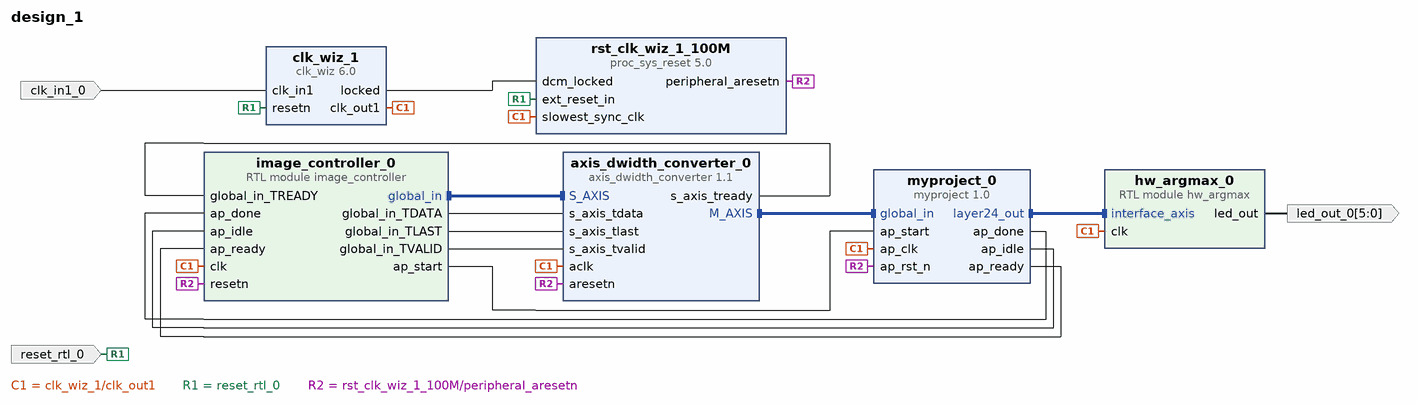
[diagram p0: block diagram of the top level]
# Vivado block design design_1, xc7a35tftg256-1, Vivado 2026.1
create_bd_design design_1

create_bd_port -dir I -type rst reset_rtl_0
set_property -dict {CONFIG.POLARITY ACTIVE_LOW} [get_bd_ports reset_rtl_0]
create_bd_port -dir I -type clk clk_in1_0
set_property -dict {CONFIG.FREQ_HZ 50000000} [get_bd_ports clk_in1_0]
create_bd_port -dir O -from 5 -to 0 led_out_0

create_bd_cell -type ip -vlnv xilinx.com:ip:clk_wiz:6.0 clk_wiz_1
set_property -dict [list \
  CONFIG.CLKIN1_JITTER_PS 200.0 \
  CONFIG.CLKOUT1_JITTER 943.481 \
  CONFIG.CLKOUT1_PHASE_ERROR 919.522 \
  CONFIG.CLKOUT1_REQUESTED_OUT_FREQ 5.000 \
  CONFIG.MMCM_CLKFBOUT_MULT_F 64.000 \
  CONFIG.MMCM_CLKIN1_PERIOD 20.000 \
  CONFIG.MMCM_CLKIN2_PERIOD 10.0 \
  CONFIG.MMCM_CLKOUT0_DIVIDE_F 128.000 \
  CONFIG.MMCM_DIVCLK_DIVIDE 5 \
  CONFIG.PRIM_IN_FREQ 50.000 \
  CONFIG.PRIM_SOURCE Single_ended_clock_capable_pin \
  CONFIG.RESET_PORT resetn \
  CONFIG.RESET_TYPE ACTIVE_LOW \
] [get_bd_cells clk_wiz_1]
create_bd_cell -type ip -vlnv xilinx.com:ip:proc_sys_reset:5.0 rst_clk_wiz_1_100M
create_bd_cell -type module -reference image_controller image_controller_0
create_bd_cell -type module -reference hw_argmax hw_argmax_0
create_bd_cell -type ip -vlnv xilinx.com:ip:axis_dwidth_converter:1.1 axis_dwidth_converter_0
set_property -dict [list \
  CONFIG.HAS_TLAST 1 \
  CONFIG.M_TDATA_NUM_BYTES 56 \
  CONFIG.S_TDATA_NUM_BYTES 2 \
] [get_bd_cells axis_dwidth_converter_0]
create_bd_cell -type ip -vlnv xilinx.com:hls:myproject:1.0 myproject_0

# ---- connections ----

connect_bd_intf_net [get_bd_intf_pins myproject_0/global_in] [get_bd_intf_pins axis_dwidth_converter_0/M_AXIS]
connect_bd_intf_net [get_bd_intf_pins image_controller_0/global_in] [get_bd_intf_pins axis_dwidth_converter_0/S_AXIS]
connect_bd_intf_net [get_bd_intf_pins myproject_0/layer24_out] [get_bd_intf_pins hw_argmax_0/interface_axis]
connect_bd_net [get_bd_pins axis_dwidth_converter_0/s_axis_tready] [get_bd_pins image_controller_0/global_in_TREADY]
connect_bd_net -net clk_in1_0_1 [get_bd_ports clk_in1_0] [get_bd_pins clk_wiz_1/clk_in1]
connect_bd_net [get_bd_pins clk_wiz_1/locked] [get_bd_pins rst_clk_wiz_1_100M/dcm_locked]
connect_bd_net [get_bd_pins hw_argmax_0/led_out] [get_bd_ports led_out_0]
connect_bd_net [get_bd_pins image_controller_0/ap_start] [get_bd_pins myproject_0/ap_start]
connect_bd_net [get_bd_pins image_controller_0/global_in_TDATA] [get_bd_pins axis_dwidth_converter_0/s_axis_tdata]
connect_bd_net [get_bd_pins image_controller_0/global_in_TLAST] [get_bd_pins axis_dwidth_converter_0/s_axis_tlast]
connect_bd_net [get_bd_pins image_controller_0/global_in_TVALID] [get_bd_pins axis_dwidth_converter_0/s_axis_tvalid]
connect_bd_net -net microblaze_0_Clk [get_bd_pins clk_wiz_1/clk_out1] \
  [get_bd_pins rst_clk_wiz_1_100M/slowest_sync_clk] [get_bd_pins hw_argmax_0/clk] [get_bd_pins axis_dwidth_converter_0/aclk] \
  [get_bd_pins image_controller_0/clk] [get_bd_pins myproject_0/ap_clk]
connect_bd_net [get_bd_pins myproject_0/ap_done] [get_bd_pins image_controller_0/ap_done]
connect_bd_net [get_bd_pins myproject_0/ap_idle] [get_bd_pins image_controller_0/ap_idle]
connect_bd_net [get_bd_pins myproject_0/ap_ready] [get_bd_pins image_controller_0/ap_ready]
connect_bd_net -net reset_rtl_0_1 [get_bd_ports reset_rtl_0] [get_bd_pins rst_clk_wiz_1_100M/ext_reset_in] [get_bd_pins clk_wiz_1/resetn]
connect_bd_net [get_bd_pins rst_clk_wiz_1_100M/peripheral_aresetn] \
  [get_bd_pins axis_dwidth_converter_0/aresetn] [get_bd_pins image_controller_0/resetn] [get_bd_pins myproject_0/ap_rst_n]

validate_bd_design
save_bd_design
